# Altium schematic sheet Sheet1.SchDoc
size A3
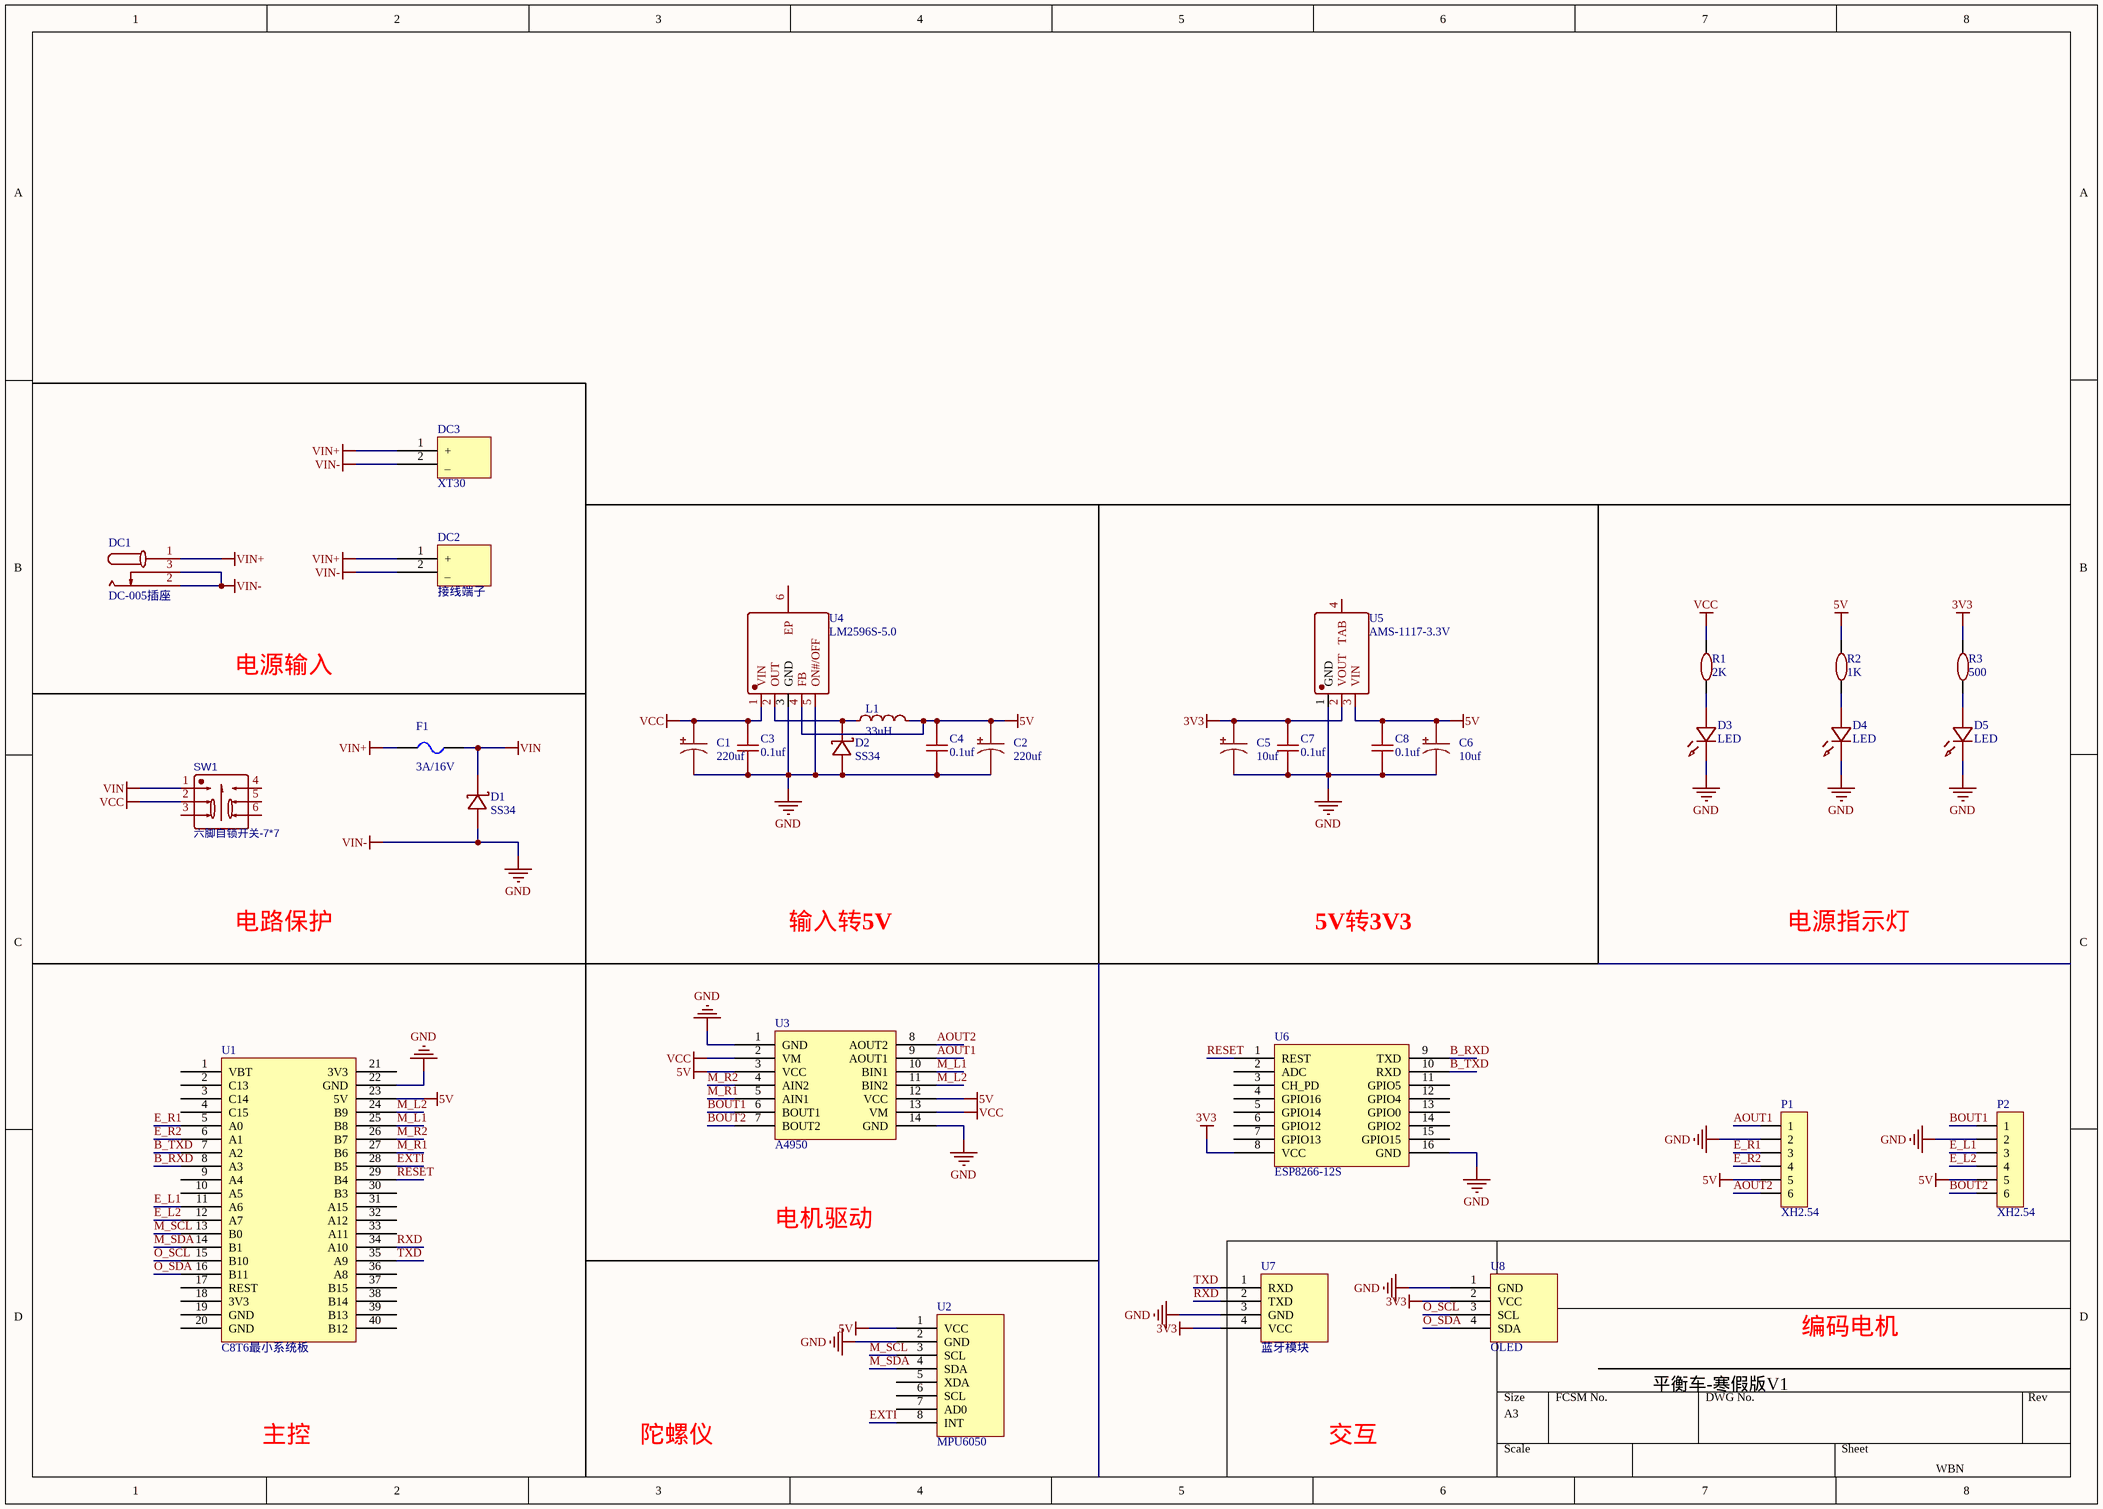
[diagram p0: Sheet1.SchDoc]

## Parts
C1  220uf  [CAP 2.5*6.3*11.2]
C2  220uf  [CAP 2.5*6.3*11.2]
C3  0.1uf  [C_0603]
C4  0.1uf  [C_0603]
C5  10uf  [CD A(3216)]
C6  10uf  [CD A(3216)]
C7  0.1uf  [C_0603]
C8  0.1uf  [C_0603]
D1  SS34  [D_1N5819]
D2  SS34  [D_1N5819]
D3  LED  [LED_0603]
D4  LED  [LED_0603]
D5  LED  [LED_0603]
DC1  DC-005插座  [DC-005-5.5*2.1]
DC2  接线端子  [接线端子]
DC3  XT30  [XT30-M]
F1  3A/16V  [FU 1812]
L1  33uH  [L_SWPA4020]
P1  XH2.54  [XH2.54-LI-6P]
P2  XH2.54  [XH2.54-LI-6P]
R1  2K  [R_0603]
R2  1K  [R_0603]
R3  500  [R_0603]
SW1  六脚自锁开关-7*7  [KFT DIP-7X7]
U1  C8T6最小系统板  [C8T6最小系统板]
U2  MPU6050  [MPU6050]
U3  A4950  [A4950]
U4  LM2596S-5.0  [T0263]
U5  AMS-1117-3.3V  [SOT223]
U6  ESP8266-12S  [ESP8266-12S]
U7  蓝牙模块  [蓝牙模块]
U8  OLED  [OLED]

## Nets
3V3: C5.1 C7.2 R3.2 U5.2(VOUT) U6.8(VCC) U7.4(VCC) U8.2(VCC)
5V: C2.1 C4.2 C6.1 C8.2 L1.2 P1.5 P2.5 R2.2 U1.23(5V) U2.1(VCC) U3.3(VCC) U3.12(VCC) U4.4(FB) U5.3(VIN)
GND: C1.2 C2.2 C3.1 C4.1 C5.2 C6.2 C7.1 C8.1 D1.2 D2.2 D3.1(K) D4.1(K) D5.1(K) DC1.2 DC1.3 DC2.2(_) DC3.2(_) P1.2 P2.2 U1.22(GND) U2.2(GND) U3.1(GND) U3.14(GND) U4.3(GND) U4.5(ON#/OFF) U5.1(GND) U6.16(GND) U7.3(GND) U8.1(GND)  [also labelled VIN-]
VCC: C1.1 C3.2 R1.2 SW1.2 U3.2(VM) U3.13(VM) U4.1(VIN)
VIN: D1.1 F1.2 SW1.1
VIN+: DC1.1 DC2.1(+) DC3.1(+) F1.1
AOUT1: P1.1 U3.9(AOUT1)
AOUT2: P1.6 U3.8(AOUT2)
B_RXD: U1.8(A3) U6.9(TXD)
B_TXD: U1.7(A2) U6.10(RXD)
BOUT1: P2.1 U3.6(BOUT1)
BOUT2: P2.6 U3.7(BOUT2)
E_L1: P2.3 U1.11(A6)
E_L2: P2.4 U1.12(A7)
E_R1: P1.3 U1.5(A0)
E_R2: P1.4 U1.6(A1)
EXTI: U1.28(B5) U2.8(INT)
M_L1: U1.25(B8) U3.10(BIN1)
M_L2: U1.24(B9) U3.11(BIN2)
M_R1: U1.27(B6) U3.5(AIN1)
M_R2: U1.26(B7) U3.4(AIN2)
M_SCL: U1.13(B0) U2.3(SCL)
M_SDA: U1.14(B1) U2.4(SDA)
O_SCL: U1.15(B10) U8.3(SCL)
O_SDA: U1.16(B11) U8.4(SDA)
RESET: U1.29(B4) U6.1(REST)
RXD: U1.34(A10) U7.2(TXD)
TXD: U1.35(A9) U7.1(RXD)
NetD2_1: D2.1 L1.1 U4.2(OUT)
NetD3_2: D3.2(A) R1.1
NetD4_2: D4.2(A) R2.1
NetD5_2: D5.2(A) R3.1

Not connected (* = marked no-connect by the designer): SW1 3 4 5 6; U1 1(VBT) 2(C13) 3(C14) 4(C15) 9(A4) 10(A5) 17(REST) 18(3V3) 19(GND) 20(GND) 21(3V3) 30(B3) 31(A15) 32(A12) 33(A11) 36(A8) 37(B15) 38(B14) 39(B13) 40(B12); U2 5(XDA) 6(SCL) 7(AD0); U4 6(EP); U5 4(TAB); U6 2(ADC) 3(CH_PD) 4(GPIO16) 5(GPIO14) 6(GPIO12) 7(GPIO13) 11(GPIO5) 12(GPIO4) 13(GPIO0) 14(GPIO2) 15(GPIO15)

## Notes on the sheet
- 电源输入
- 电路保护
- 输入转5V
- 5V转3V3
- 电源指示灯
- 电机驱动
- 平衡车-寒假版V1
- 编码电机
- 主控
- 陀螺仪
- 交互
- WBN

## Library data of the parts
C1 C2 = C_6*11: 25V/220uf
C3 C4 C7 C8 = C_0603: 4.7nf-4.7uf
C5 C6 = C_A型钽电容: 16V/10uf
D1 D2 = SS34: 3A/40
D3-D5 = LED_0603
F1 = FU: BOM名称: 贴片保险丝; 版权归属: 封装库来自淘宝卖家 ID：黄晶宝石; 学习资源: https://shop463601444.taobao.com
L1 = L_33uH_4020: 1.5uH-33uH
R1-R3 = R_0603
SW1 = 六脚自锁开关-7*7: BOM_Manufacturer: XKB Enterprise; BOM_Manufacturer Part: XKB7070-Z-92; Contributor: LCSC; BOM_Supplier: LCSC; BOM_Supplier Part: C318862; BOM_JLCPCB Part Class: Extended Part; spicePre: S; spiceSymbolName: XKB7070-Z-92
U4 = LM2596S: 降压3.3V-12V
U5 = AMS1117: 降压1.2V-5V
U7 = 蓝牙模块: 四线蓝牙模块